# Altium project Matrix.PrjPCB
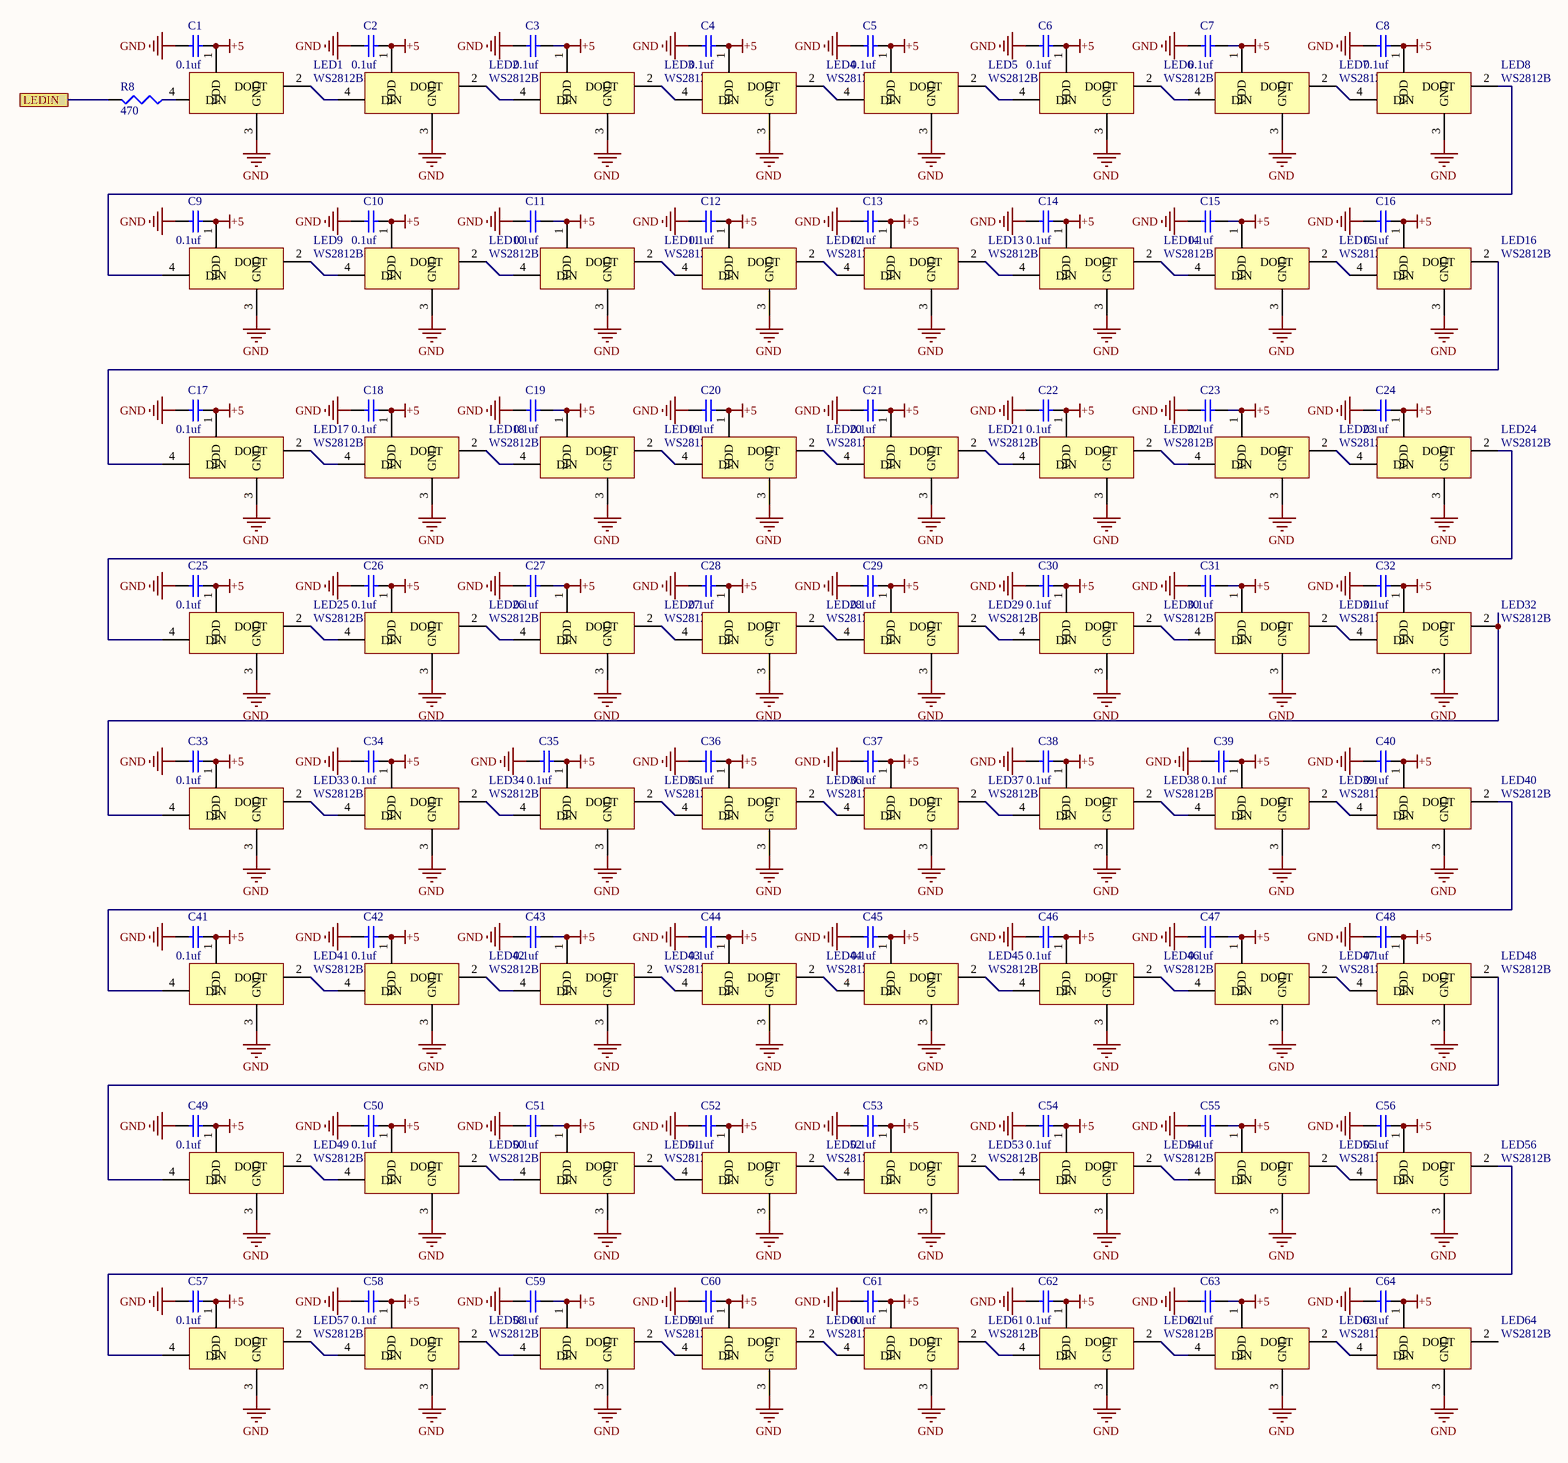
[diagram p0: led.SchDoc]
3 sheets, 297 parts. Net scope: flat (ports and power ports of the same name join across sheets).
Board files: MatrixRE.PcbDoc, MatrixC8.PcbDoc, TouchBar.PcbDoc
Sheets:
  led.SchDoc
  matrixkeypad.SchDoc
  MCU.SchDoc

## Sheet led.SchDoc
size A0

### Parts
(Parts that share a designator on the sheet are numbered #1, #2 ... from top to bottom, then left to right.)
C1#1  value 0.1uf  [C1206]  (hidden comment: Cap Semi)
C2#1  value 0.1uf  [C1206]  (hidden comment: Cap Semi)
C3#1  value 0.1uf  [C1206]  (hidden comment: Cap Semi)
C4#1  value 0.1uf  [C1206]  (hidden comment: Cap Semi)
C5#1  value 0.1uf  [C1206]  (hidden comment: Cap Semi)
C6#1  value 0.1uf  [C1206]  (hidden comment: Cap Semi)
C7#1  value 0.1uf  [C1206]  (hidden comment: Cap Semi)
C8#1  value 0.1uf  [C1206]  (hidden comment: Cap Semi)
C9#1  value 0.1uf  [C1206]  (hidden comment: Cap Semi)
C10#1  value 0.1uf  [C1206]  (hidden comment: Cap Semi)
C11#1  value 0.1uf  [C1206]  (hidden comment: Cap Semi)
C12#1  value 0.1uf  [C1206]  (hidden comment: Cap Semi)
C13  value 0.1uf  [C1206]  (hidden comment: Cap Semi)
C14  value 0.1uf  [C1206]  (hidden comment: Cap Semi)
C15  value 0.1uf  [C1206]  (hidden comment: Cap Semi)
C16  value 0.1uf  [C1206]  (hidden comment: Cap Semi)
C17  value 0.1uf  [C1206]  (hidden comment: Cap Semi)
C18  value 0.1uf  [C1206]  (hidden comment: Cap Semi)
C19  value 0.1uf  [C1206]  (hidden comment: Cap Semi)
C20  value 0.1uf  [C1206]  (hidden comment: Cap Semi)
C21  value 0.1uf  [C1206]  (hidden comment: Cap Semi)
C22  value 0.1uf  [C1206]  (hidden comment: Cap Semi)
C23  value 0.1uf  [C1206]  (hidden comment: Cap Semi)
C24  value 0.1uf  [C1206]  (hidden comment: Cap Semi)
C25  value 0.1uf  [C1206]  (hidden comment: Cap Semi)
C26  value 0.1uf  [C1206]  (hidden comment: Cap Semi)
C27  value 0.1uf  [C1206]  (hidden comment: Cap Semi)
C28  value 0.1uf  [C1206]  (hidden comment: Cap Semi)
C29  value 0.1uf  [C1206]  (hidden comment: Cap Semi)
C30  value 0.1uf  [C1206]  (hidden comment: Cap Semi)
C31  value 0.1uf  [C1206]  (hidden comment: Cap Semi)
C32  value 0.1uf  [C1206]  (hidden comment: Cap Semi)
C33  value 0.1uf  [C1206]  (hidden comment: Cap Semi)
C34  value 0.1uf  [C1206]  (hidden comment: Cap Semi)
C35  value 0.1uf  [C1206]  (hidden comment: Cap Semi)
C36  value 0.1uf  [C1206]  (hidden comment: Cap Semi)
C37  value 0.1uf  [C1206]  (hidden comment: Cap Semi)
C38  value 0.1uf  [C1206]  (hidden comment: Cap Semi)
C39  value 0.1uf  [C1206]  (hidden comment: Cap Semi)
C40  value 0.1uf  [C1206]  (hidden comment: Cap Semi)
C41  value 0.1uf  [C1206]  (hidden comment: Cap Semi)
C42  value 0.1uf  [C1206]  (hidden comment: Cap Semi)
C43  value 0.1uf  [C1206]  (hidden comment: Cap Semi)
C44  value 0.1uf  [C1206]  (hidden comment: Cap Semi)
C45  value 0.1uf  [C1206]  (hidden comment: Cap Semi)
C46  value 0.1uf  [C1206]  (hidden comment: Cap Semi)
C47  value 0.1uf  [C1206]  (hidden comment: Cap Semi)
C48  value 0.1uf  [C1206]  (hidden comment: Cap Semi)
C49  value 0.1uf  [C1206]  (hidden comment: Cap Semi)
C50  value 0.1uf  [C1206]  (hidden comment: Cap Semi)
C51  value 0.1uf  [C1206]  (hidden comment: Cap Semi)
C52  value 0.1uf  [C1206]  (hidden comment: Cap Semi)
C53  value 0.1uf  [C1206]  (hidden comment: Cap Semi)
C54  value 0.1uf  [C1206]  (hidden comment: Cap Semi)
C55  value 0.1uf  [C1206]  (hidden comment: Cap Semi)
C56  value 0.1uf  [C1206]  (hidden comment: Cap Semi)
C57  value 0.1uf  [C1206]  (hidden comment: Cap Semi)
C58  value 0.1uf  [C1206]  (hidden comment: Cap Semi)
C59  value 0.1uf  [C1206]  (hidden comment: Cap Semi)
C60  value 0.1uf  [C1206]  (hidden comment: Cap Semi)
C61  value 0.1uf  [C1206]  (hidden comment: Cap Semi)
C62  value 0.1uf  [C1206]  (hidden comment: Cap Semi)
C63  value 0.1uf  [C1206]  (hidden comment: Cap Semi)
C64  value 0.1uf  [C1206]  (hidden comment: Cap Semi)
LED1  WS2812B  [WS2812B]
LED2  WS2812B  [WS2812B]
LED3  WS2812B  [WS2812B]
LED4  WS2812B  [WS2812B]
LED5  WS2812B  [WS2812B]
LED6  WS2812B  [WS2812B]
LED7  WS2812B  [WS2812B]
LED8  WS2812B  [WS2812B]
LED9  WS2812B  [WS2812B]
LED10  WS2812B  [WS2812B]
LED11  WS2812B  [WS2812B]
LED12  WS2812B  [WS2812B]
LED13  WS2812B  [WS2812B]
LED14  WS2812B  [WS2812B]
LED15  WS2812B  [WS2812B]
LED16  WS2812B  [WS2812B]
LED17  WS2812B  [WS2812B]
LED18  WS2812B  [WS2812B]
LED19  WS2812B  [WS2812B]
LED20  WS2812B  [WS2812B]
LED21  WS2812B  [WS2812B]
LED22  WS2812B  [WS2812B]
LED23  WS2812B  [WS2812B]
LED24  WS2812B  [WS2812B]
LED25  WS2812B  [WS2812B]
LED26  WS2812B  [WS2812B]
LED27  WS2812B  [WS2812B]
LED28  WS2812B  [WS2812B]
LED29  WS2812B  [WS2812B]
LED30  WS2812B  [WS2812B]
LED31  WS2812B  [WS2812B]
LED32  WS2812B  [WS2812B]
LED33  WS2812B  [WS2812B]
LED34  WS2812B  [WS2812B]
LED35  WS2812B  [WS2812B]
LED36  WS2812B  [WS2812B]
LED37  WS2812B  [WS2812B]
LED38  WS2812B  [WS2812B]
LED39  WS2812B  [WS2812B]
LED40  WS2812B  [WS2812B]
LED41  WS2812B  [WS2812B]
LED42  WS2812B  [WS2812B]
LED43  WS2812B  [WS2812B]
LED44  WS2812B  [WS2812B]
LED45  WS2812B  [WS2812B]
LED46  WS2812B  [WS2812B]
LED47  WS2812B  [WS2812B]
LED48  WS2812B  [WS2812B]
LED49  WS2812B  [WS2812B]
LED50  WS2812B  [WS2812B]
LED51  WS2812B  [WS2812B]
LED52  WS2812B  [WS2812B]
LED53  WS2812B  [WS2812B]
LED54  WS2812B  [WS2812B]
LED55  WS2812B  [WS2812B]
LED56  WS2812B  [WS2812B]
LED57  WS2812B  [WS2812B]
LED58  WS2812B  [WS2812B]
LED59  WS2812B  [WS2812B]
LED60  WS2812B  [WS2812B]
LED61  WS2812B  [WS2812B]
LED62  WS2812B  [WS2812B]
LED63  WS2812B  [WS2812B]
LED64  WS2812B  [WS2812B]
R8#1  value 470  [C1206]  (hidden comment: res)

### Ports
LEDIN

### Nets
+5: C1#1.2 C2#1.2 C3#1.2 C4#1.2 C5#1.2 C6#1.2 C7#1.2 C8#1.2 C9#1.2 C10#1.2 C11#1.2 C12#1.2 C13.2 C14.2 C15.2 C16.2 C17.2 C18.2 C19.2 C20.2 C21.2 C22.2 C23.2 C24.2 C25.2 C26.2 C27.2 C28.2 C29.2 C30.2 C31.2 C32.2 C33.2 C34.2 C35.2 C36.2 C37.2 C38.2 C39.2 C40.2 C41.2 C42.2 C43.2 C44.2 C45.2 C46.2 C47.2 C48.2 C49.2 C50.2 C51.2 C52.2 C53.2 C54.2 C55.2 C56.2 C57.2 C58.2 C59.2 C60.2 C61.2 C62.2 C63.2 C64.2 LED1.1(VDD) LED2.1(VDD) LED3.1(VDD) LED4.1(VDD) LED5.1(VDD) LED6.1(VDD) LED7.1(VDD) LED8.1(VDD) LED9.1(VDD) LED10.1(VDD) LED11.1(VDD) LED12.1(VDD) LED13.1(VDD) LED14.1(VDD) LED15.1(VDD) LED16.1(VDD) LED17.1(VDD) LED18.1(VDD) LED19.1(VDD) LED20.1(VDD) LED21.1(VDD) LED22.1(VDD) LED23.1(VDD) LED24.1(VDD) LED25.1(VDD) LED26.1(VDD) LED27.1(VDD) LED28.1(VDD) LED29.1(VDD) LED30.1(VDD) LED31.1(VDD) LED32.1(VDD) LED33.1(VDD) LED34.1(VDD) LED35.1(VDD) LED36.1(VDD) LED37.1(VDD) LED38.1(VDD) LED39.1(VDD) LED40.1(VDD) LED41.1(VDD) LED42.1(VDD) LED43.1(VDD) LED44.1(VDD) LED45.1(VDD) LED46.1(VDD) LED47.1(VDD) LED48.1(VDD) LED49.1(VDD) LED50.1(VDD) LED51.1(VDD) LED52.1(VDD) LED53.1(VDD) LED54.1(VDD) LED55.1(VDD) LED56.1(VDD) LED57.1(VDD) LED58.1(VDD) LED59.1(VDD) LED60.1(VDD) LED61.1(VDD) LED62.1(VDD) LED63.1(VDD) LED64.1(VDD)
GND: C1#1.1 C2#1.1 C3#1.1 C4#1.1 C5#1.1 C6#1.1 C7#1.1 C8#1.1 C9#1.1 C10#1.1 C11#1.1 C12#1.1 C13.1 C14.1 C15.1 C16.1 C17.1 C18.1 C19.1 C20.1 C21.1 C22.1 C23.1 C24.1 C25.1 C26.1 C27.1 C28.1 C29.1 C30.1 C31.1 C32.1 C33.1 C34.1 C35.1 C36.1 C37.1 C38.1 C39.1 C40.1 C41.1 C42.1 C43.1 C44.1 C45.1 C46.1 C47.1 C48.1 C49.1 C50.1 C51.1 C52.1 C53.1 C54.1 C55.1 C56.1 C57.1 C58.1 C59.1 C60.1 C61.1 C62.1 C63.1 C64.1 LED1.3(GND) LED2.3(GND) LED3.3(GND) LED4.3(GND) LED5.3(GND) LED6.3(GND) LED7.3(GND) LED8.3(GND) LED9.3(GND) LED10.3(GND) LED11.3(GND) LED12.3(GND) LED13.3(GND) LED14.3(GND) LED15.3(GND) LED16.3(GND) LED17.3(GND) LED18.3(GND) LED19.3(GND) LED20.3(GND) LED21.3(GND) LED22.3(GND) LED23.3(GND) LED24.3(GND) LED25.3(GND) LED26.3(GND) LED27.3(GND) LED28.3(GND) LED29.3(GND) LED30.3(GND) LED31.3(GND) LED32.3(GND) LED33.3(GND) LED34.3(GND) LED35.3(GND) LED36.3(GND) LED37.3(GND) LED38.3(GND) LED39.3(GND) LED40.3(GND) LED41.3(GND) LED42.3(GND) LED43.3(GND) LED44.3(GND) LED45.3(GND) LED46.3(GND) LED47.3(GND) LED48.3(GND) LED49.3(GND) LED50.3(GND) LED51.3(GND) LED52.3(GND) LED53.3(GND) LED54.3(GND) LED55.3(GND) LED56.3(GND) LED57.3(GND) LED58.3(GND) LED59.3(GND) LED60.3(GND) LED61.3(GND) LED62.3(GND) LED63.3(GND) LED64.3(GND)
NetLED1_2: LED1.2(DOUT) LED2.4(DIN)
NetLED1_4: LED1.4(DIN) R8#1.1
NetLED2_2: LED2.2(DOUT) LED3.4(DIN)
NetLED3_2: LED3.2(DOUT) LED4.4(DIN)
NetLED4_2: LED4.2(DOUT) LED5.4(DIN)
NetLED5_2: LED5.2(DOUT) LED6.4(DIN)
NetLED6_2: LED6.2(DOUT) LED7.4(DIN)
NetLED7_2: LED7.2(DOUT) LED8.4(DIN)
NetLED8_2: LED8.2(DOUT) LED9.4(DIN)
NetLED9_2: LED9.2(DOUT) LED10.4(DIN)
NetLED10_2: LED10.2(DOUT) LED11.4(DIN)
NetLED11_2: LED11.2(DOUT) LED12.4(DIN)
NetLED12_2: LED12.2(DOUT) LED13.4(DIN)
NetLED13_2: LED13.2(DOUT) LED14.4(DIN)
NetLED14_2: LED14.2(DOUT) LED15.4(DIN)
NetLED15_2: LED15.2(DOUT) LED16.4(DIN)
NetLED16_2: LED16.2(DOUT) LED17.4(DIN)
NetLED17_2: LED17.2(DOUT) LED18.4(DIN)
NetLED18_2: LED18.2(DOUT) LED19.4(DIN)
NetLED19_2: LED19.2(DOUT) LED20.4(DIN)
NetLED20_2: LED20.2(DOUT) LED21.4(DIN)
NetLED21_2: LED21.2(DOUT) LED22.4(DIN)
NetLED22_2: LED22.2(DOUT) LED23.4(DIN)
NetLED23_2: LED23.2(DOUT) LED24.4(DIN)
NetLED24_2: LED24.2(DOUT) LED25.4(DIN)
NetLED25_2: LED25.2(DOUT) LED26.4(DIN)
NetLED26_2: LED26.2(DOUT) LED27.4(DIN)
NetLED27_2: LED27.2(DOUT) LED28.4(DIN)
NetLED28_2: LED28.2(DOUT) LED29.4(DIN)
NetLED29_2: LED29.2(DOUT) LED30.4(DIN)
NetLED30_2: LED30.2(DOUT) LED31.4(DIN)
NetLED31_2: LED31.2(DOUT) LED32.4(DIN)
NetLED32_2: LED32.2(DOUT) LED33.4(DIN)
NetLED33_2: LED33.2(DOUT) LED34.4(DIN)
NetLED34_2: LED34.2(DOUT) LED35.4(DIN)
NetLED35_2: LED35.2(DOUT) LED36.4(DIN)
NetLED36_2: LED36.2(DOUT) LED37.4(DIN)
NetLED37_2: LED37.2(DOUT) LED38.4(DIN)
NetLED38_2: LED38.2(DOUT) LED39.4(DIN)
NetLED39_2: LED39.2(DOUT) LED40.4(DIN)
NetLED40_2: LED40.2(DOUT) LED41.4(DIN)
NetLED41_2: LED41.2(DOUT) LED42.4(DIN)
NetLED42_2: LED42.2(DOUT) LED43.4(DIN)
NetLED43_2: LED43.2(DOUT) LED44.4(DIN)
NetLED44_2: LED44.2(DOUT) LED45.4(DIN)
NetLED45_2: LED45.2(DOUT) LED46.4(DIN)
NetLED46_2: LED46.2(DOUT) LED47.4(DIN)
NetLED47_2: LED47.2(DOUT) LED48.4(DIN)
NetLED48_2: LED48.2(DOUT) LED49.4(DIN)
NetLED49_2: LED49.2(DOUT) LED50.4(DIN)
NetLED50_2: LED50.2(DOUT) LED51.4(DIN)
NetLED51_2: LED51.2(DOUT) LED52.4(DIN)
NetLED52_2: LED52.2(DOUT) LED53.4(DIN)
NetLED53_2: LED53.2(DOUT) LED54.4(DIN)
NetLED54_2: LED54.2(DOUT) LED55.4(DIN)
NetLED55_2: LED55.2(DOUT) LED56.4(DIN)
NetLED56_2: LED56.2(DOUT) LED57.4(DIN)
NetLED57_2: LED57.2(DOUT) LED58.4(DIN)
NetLED58_2: LED58.2(DOUT) LED59.4(DIN)
NetLED59_2: LED59.2(DOUT) LED60.4(DIN)
NetLED60_2: LED60.2(DOUT) LED61.4(DIN)
NetLED61_2: LED61.2(DOUT) LED62.4(DIN)
NetLED62_2: LED62.2(DOUT) LED63.4(DIN)
NetLED63_2: LED63.2(DOUT) LED64.4(DIN)
NetR8#1_2: R8#1.2 ; port LEDIN

Not connected (* = marked no-connect by the designer): LED64 2(DOUT)

### Library data of the parts
C1#1 C2#1 C3#1 C4#1 C5#1 C6#1 C7#1 C8#1 C9#1 C10#1 C11#1 C12#1 C13-C64 = Cap Semi: Capacitor (Semiconductor SIM Model); Published: 8-Jun-2000; LatestRevisionDate: 29-May-2009; LatestRevisionNote: IPC-7351 Footprint Added.; PackageReference: C1206; Publisher: Altium Limited; PackageDescription: Chip Capacitor
LED1-LED64 = WS2812B: 3535
R8#1 = Res3: Resistor; Published: 8-Jun-2000; LatestRevisionDate: 29-May-2009; LatestRevisionNote: IPC-7351 Footprint Added.; PackageReference: J1-0603; Publisher: Altium Limited; PackageDescription: Chip Resistor

## Sheet matrixkeypad.SchDoc
size A4
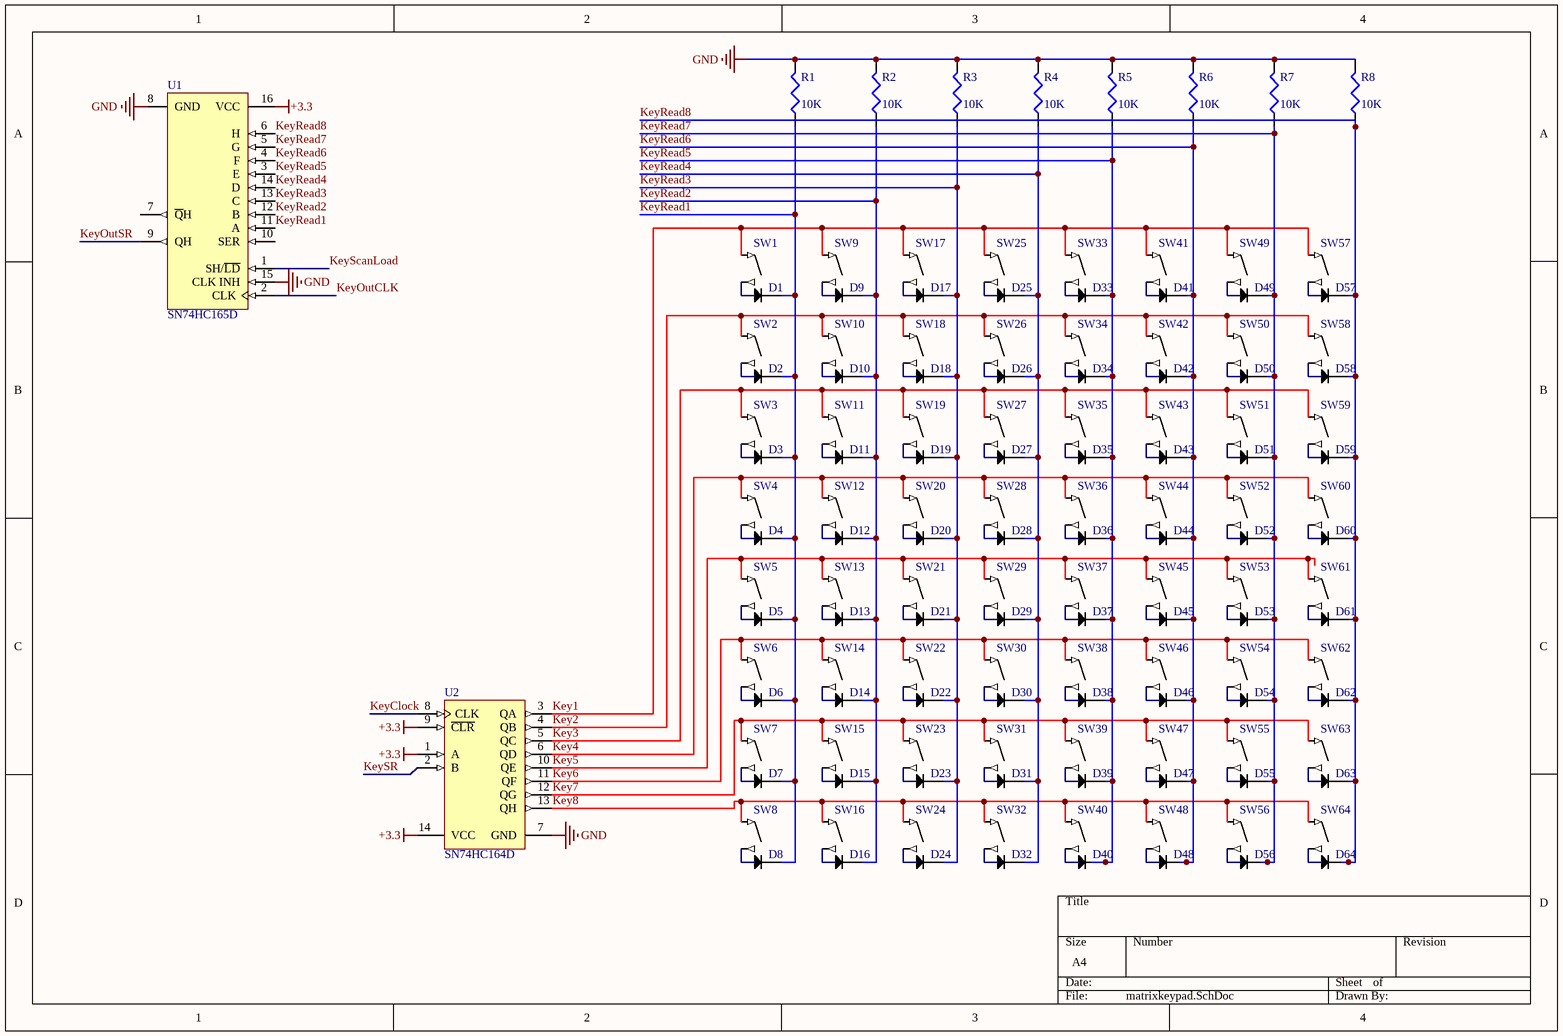
[diagram p1: matrixkeypad.SchDoc]

### Parts
(Parts that share a designator on the sheet are numbered #1, #2 ... from top to bottom, then left to right.)
D1#1  1N4148  [SOD123]  (value not drawn)
D2#1  1N4148  [SOD123]  (value not drawn)
D3  1N4148  [SOD123]  (value not drawn)
D4  1N4148  [SOD123]  (value not drawn)
D5  1N4148  [SOD123]  (value not drawn)
D6  1N4148  [SOD123]  (value not drawn)
D7  1N4148  [SOD123]  (value not drawn)
D8  1N4148  [SOD123]  (value not drawn)
D9  1N4148  [SOD123]  (value not drawn)
D10  1N4148  [SOD123]  (value not drawn)
D11  1N4148  [SOD123]  (value not drawn)
D12  1N4148  [SOD123]  (value not drawn)
D13  1N4148  [SOD123]  (value not drawn)
D14  1N4148  [SOD123]  (value not drawn)
D15  1N4148  [SOD123]  (value not drawn)
D16  1N4148  [SOD123]  (value not drawn)
D17  1N4148  [SOD123]  (value not drawn)
D18  1N4148  [SOD123]  (value not drawn)
D19  1N4148  [SOD123]  (value not drawn)
D20  1N4148  [SOD123]  (value not drawn)
D21  1N4148  [SOD123]  (value not drawn)
D22  1N4148  [SOD123]  (value not drawn)
D23  1N4148  [SOD123]  (value not drawn)
D24  1N4148  [SOD123]  (value not drawn)
D25  1N4148  [SOD123]  (value not drawn)
D26  1N4148  [SOD123]  (value not drawn)
D27  1N4148  [SOD123]  (value not drawn)
D28  1N4148  [SOD123]  (value not drawn)
D29  1N4148  [SOD123]  (value not drawn)
D30  1N4148  [SOD123]  (value not drawn)
D31  1N4148  [SOD123]  (value not drawn)
D32  1N4148  [SOD123]  (value not drawn)
D33  1N4148  [SOD123]  (value not drawn)
D34  1N4148  [SOD123]  (value not drawn)
D35  1N4148  [SOD123]  (value not drawn)
D36  1N4148  [SOD123]  (value not drawn)
D37  1N4148  [SOD123]  (value not drawn)
D38  1N4148  [SOD123]  (value not drawn)
D39  1N4148  [SOD123]  (value not drawn)
D40  1N4148  [SOD123]  (value not drawn)
D41  1N4148  [SOD123]  (value not drawn)
D42  1N4148  [SOD123]  (value not drawn)
D43  1N4148  [SOD123]  (value not drawn)
D44  1N4148  [SOD123]  (value not drawn)
D45  1N4148  [SOD123]  (value not drawn)
D46  1N4148  [SOD123]  (value not drawn)
D47  1N4148  [SOD123]  (value not drawn)
D48  1N4148  [SOD123]  (value not drawn)
D49  1N4148  [SOD123]  (value not drawn)
D50  1N4148  [SOD123]  (value not drawn)
D51  1N4148  [SOD123]  (value not drawn)
D52  1N4148  [SOD123]  (value not drawn)
D53  1N4148  [SOD123]  (value not drawn)
D54  1N4148  [SOD123]  (value not drawn)
D55  1N4148  [SOD123]  (value not drawn)
D56  1N4148  [SOD123]  (value not drawn)
D57  1N4148  [SOD123]  (value not drawn)
D58  1N4148  [SOD123]  (value not drawn)
D59  1N4148  [SOD123]  (value not drawn)
D60  1N4148  [SOD123]  (value not drawn)
D61  1N4148  [SOD123]  (value not drawn)
D62  1N4148  [SOD123]  (value not drawn)
D63  1N4148  [SOD123]  (value not drawn)
D64  1N4148  [SOD123]  (value not drawn)
R1#1  value 10K  [C1206]  (hidden comment: res)
R2#1  value 10K  [C1206]  (hidden comment: res)
R3#1  value 10K  [C1206]  (hidden comment: res)
R4#1  value 10K  [C1206]  (hidden comment: res)
R5#1  value 10K  [C1206]  (hidden comment: res)
R6#1  value 10K  [C1206]  (hidden comment: res)
R7#1  value 10K  [C1206]  (hidden comment: res)
R8#2  value 10K  [C1206]  (hidden comment: res)
SW1  (no value)  [PAD]
SW2  (no value)  [PAD]
SW3  (no value)  [PAD]
SW4  (no value)  [PAD]
SW5  (no value)  [PAD]
SW6  (no value)  [PAD]
SW7  (no value)  [PAD]
SW8  (no value)  [PAD]
SW9  (no value)  [PAD]
SW10  (no value)  [PAD]
SW11  (no value)  [PAD]
SW12  (no value)  [PAD]
SW13  (no value)  [PAD]
SW14  (no value)  [PAD]
SW15  (no value)  [PAD]
SW16  (no value)  [PAD]
SW17  (no value)  [PAD]
SW18  (no value)  [PAD]
SW19  (no value)  [PAD]
SW20  (no value)  [PAD]
SW21  (no value)  [PAD]
SW22  (no value)  [PAD]
SW23  (no value)  [PAD]
SW24  (no value)  [PAD]
SW25  (no value)  [PAD]
SW26  (no value)  [PAD]
SW27  (no value)  [PAD]
SW28  (no value)  [PAD]
SW29  (no value)  [PAD]
SW30  (no value)  [PAD]
SW31  (no value)  [PAD]
SW32  (no value)  [PAD]
SW33  (no value)  [PAD]
SW34  (no value)  [PAD]
SW35  (no value)  [PAD]
SW36  (no value)  [PAD]
SW37  (no value)  [PAD]
SW38  (no value)  [PAD]
SW39  (no value)  [PAD]
SW40  (no value)  [PAD]
SW41  (no value)  [PAD]
SW42  (no value)  [PAD]
SW43  (no value)  [PAD]
SW44  (no value)  [PAD]
SW45  (no value)  [PAD]
SW46  (no value)  [PAD]
SW47  (no value)  [PAD]
SW48  (no value)  [PAD]
SW49  (no value)  [PAD]
SW50  (no value)  [PAD]
SW51  (no value)  [PAD]
SW52  (no value)  [PAD]
SW53  (no value)  [PAD]
SW54  (no value)  [PAD]
SW55  (no value)  [PAD]
SW56  (no value)  [PAD]
SW57  (no value)  [PAD]
SW58  (no value)  [PAD]
SW59  (no value)  [PAD]
SW60  (no value)  [PAD]
SW61  (no value)  [PAD]
SW62  (no value)  [PAD]
SW63  (no value)  [PAD]
SW64  (no value)  [PAD]
U1  SN74HC165D  [D0016A_N]
U2  SN74HC164D  [D0014A_N]

### Nets
+3.3: U1.16(VCC) U2.1(A) U2.9(~{CLR}) U2.14(VCC)
GND: R1#1.2 R2#1.2 R3#1.2 R4#1.2 R5#1.2 R6#1.2 R7#1.2 R8#2.2 U1.15(CLK_INH) U2.7(GND)
Key1: SW1.1 SW9.1 SW17.1 SW25.1 SW33.1 SW41.1 SW49.1 SW57.1 U2.3(QA)
Key2: SW2.1 SW10.1 SW18.1 SW26.1 SW34.1 SW42.1 SW50.1 SW58.1 U2.4(QB)
Key3: SW3.1 SW11.1 SW19.1 SW27.1 SW35.1 SW43.1 SW51.1 SW59.1 U2.5(QC)
Key4: SW4.1 SW12.1 SW20.1 SW28.1 SW36.1 SW44.1 SW52.1 SW60.1 U2.6(QD)
Key5: SW5.1 SW13.1 SW21.1 SW29.1 SW37.1 SW45.1 SW53.1 SW61.1 U2.10(QE)
Key6: SW6.1 SW14.1 SW22.1 SW30.1 SW38.1 SW46.1 SW54.1 SW62.1 U2.11(QF)
Key7: SW7.1 SW15.1 SW23.1 SW31.1 SW39.1 SW47.1 SW55.1 SW63.1 U2.12(QG)
Key8: SW8.1 SW16.1 SW24.1 SW32.1 SW40.1 SW48.1 SW56.1 SW64.1 U2.13(QH)
KeyClock: U2.8(CLK)
KeyOutCLK: U1.2(CLK)
KeyOutSR: U1.9(QH)
KeyRead1: D1#1.2 D2#1.2 D3.2 D4.2 D5.2 D6.2 D7.2 D8.2 R1#1.1 U1.11(A)
KeyRead2: D9.2 D10.2 D11.2 D12.2 D13.2 D14.2 D15.2 D16.2 R2#1.1 U1.12(B)
KeyRead3: D17.2 D18.2 D19.2 D20.2 D21.2 D22.2 D23.2 D24.2 R3#1.1 U1.13(C)
KeyRead4: D25.2 D26.2 D27.2 D28.2 D29.2 D30.2 D31.2 D32.2 R4#1.1 U1.14(D)
KeyRead5: D33.2 D34.2 D35.2 D36.2 D37.2 D38.2 D39.2 D40.2 R5#1.1 U1.3(E)
KeyRead6: D41.2 D42.2 D43.2 D44.2 D45.2 D46.2 D47.2 D48.2 R6#1.1 U1.4(F)
KeyRead7: D49.2 D50.2 D51.2 D52.2 D53.2 D54.2 D55.2 D56.2 R7#1.1 U1.5(G)
KeyRead8: D57.2 D58.2 D59.2 D60.2 D61.2 D62.2 D63.2 D64.2 R8#2.1 U1.6(H)
KeyScanLoad: U1.1(SH/~{LD})
KeySR: U2.2(B)
NetD1#1_1: D1#1.1 SW1.2(Out)
NetD2#1_1: D2#1.1 SW2.2(Out)
NetD3_1: D3.1 SW3.2(Out)
NetD4_1: D4.1 SW4.2(Out)
NetD5_1: D5.1 SW5.2(Out)
NetD6_1: D6.1 SW6.2(Out)
NetD7_1: D7.1 SW7.2(Out)
NetD8_1: D8.1 SW8.2(Out)
NetD9_1: D9.1 SW9.2(Out)
NetD10_1: D10.1 SW10.2(Out)
NetD11_1: D11.1 SW11.2(Out)
NetD12_1: D12.1 SW12.2(Out)
NetD13_1: D13.1 SW13.2(Out)
NetD14_1: D14.1 SW14.2(Out)
NetD15_1: D15.1 SW15.2(Out)
NetD16_1: D16.1 SW16.2(Out)
NetD17_1: D17.1 SW17.2(Out)
NetD18_1: D18.1 SW18.2(Out)
NetD19_1: D19.1 SW19.2(Out)
NetD20_1: D20.1 SW20.2(Out)
NetD21_1: D21.1 SW21.2(Out)
NetD22_1: D22.1 SW22.2(Out)
NetD23_1: D23.1 SW23.2(Out)
NetD24_1: D24.1 SW24.2(Out)
NetD25_1: D25.1 SW25.2(Out)
NetD26_1: D26.1 SW26.2(Out)
NetD27_1: D27.1 SW27.2(Out)
NetD28_1: D28.1 SW28.2(Out)
NetD29_1: D29.1 SW29.2(Out)
NetD30_1: D30.1 SW30.2(Out)
NetD31_1: D31.1 SW31.2(Out)
NetD32_1: D32.1 SW32.2(Out)
NetD33_1: D33.1 SW33.2(Out)
NetD34_1: D34.1 SW34.2(Out)
NetD35_1: D35.1 SW35.2(Out)
NetD36_1: D36.1 SW36.2(Out)
NetD37_1: D37.1 SW37.2(Out)
NetD38_1: D38.1 SW38.2(Out)
NetD39_1: D39.1 SW39.2(Out)
NetD40_1: D40.1 SW40.2(Out)
NetD41_1: D41.1 SW41.2(Out)
NetD42_1: D42.1 SW42.2(Out)
NetD43_1: D43.1 SW43.2(Out)
NetD44_1: D44.1 SW44.2(Out)
NetD45_1: D45.1 SW45.2(Out)
NetD46_1: D46.1 SW46.2(Out)
NetD47_1: D47.1 SW47.2(Out)
NetD48_1: D48.1 SW48.2(Out)
NetD49_1: D49.1 SW49.2(Out)
NetD50_1: D50.1 SW50.2(Out)
NetD51_1: D51.1 SW51.2(Out)
NetD52_1: D52.1 SW52.2(Out)
NetD53_1: D53.1 SW53.2(Out)
NetD54_1: D54.1 SW54.2(Out)
NetD55_1: D55.1 SW55.2(Out)
NetD56_1: D56.1 SW56.2(Out)
NetD57_1: D57.1 SW57.2(Out)
NetD58_1: D58.1 SW58.2(Out)
NetD59_1: D59.1 SW59.2(Out)
NetD60_1: D60.1 SW60.2(Out)
NetD61_1: D61.1 SW61.2(Out)
NetD62_1: D62.1 SW62.2(Out)
NetD63_1: D63.1 SW63.2(Out)
NetD64_1: D64.1 SW64.2(Out)

Not connected (* = marked no-connect by the designer): U1 7(~{Q}H) 8(GND) 10(SER)

### Notes on the sheet
- Labels drawn without touching a wire or pin: GND

### Library data of the parts
R1#1 R2#1 R3#1 R4#1 R5#1 R6#1 R7#1 R8#2 = Res3: Resistor; Published: 8-Jun-2000; LatestRevisionDate: 29-May-2009; LatestRevisionNote: IPC-7351 Footprint Added.; PackageReference: J1-0603; Publisher: Altium Limited; PackageDescription: Chip Resistor
SW1-SW64 = SW
U1 = SN74HC165D: 8-Bit Parallel-Load Shift Registers, D0016A, TUBE; Manufacturer: Texas Instruments; Technology Family: HC; VCC(Min)(V): 2; VCC(Max)(V): 6; F @ Nom Voltage(Max)(Mhz): 28; ICC @ Nom Voltage(Max)(mA): 0.08; tpd @ Nom Voltage(Max)(ns): 38; Output Drive (IOL/IOH)(Max)(mA): 5.2/-5.2; Input Type: CMOS; 3-State Output: No; Rating: Catalog; Bits: 8; DatasheetVersion: SCLS116G; PackageReference: D0016A; Generic Part Number: SN74HC165; Voltage(Nom)(V): 6; Output Type: CMOS; Operating Temperature Range(C): -40 to 125; Code_JEDEC: MS-012 variation AC; PartNumber: SN74HC165D; ComponentLink1Description: Manufacturer URL; ComponentLink1URL: http://www.ti.com/; ComponentLink2Description: Datasheet; ComponentLink2URL: http://www.ti.com/lit/ds/symlink/sn74hc165.pdf; ComponentLink3Description: Package Specification; ComponentLink3URL: http://www.ti.com/lit/ml/mpds178g/mpds178g.pdf
U2 = SN74HC164D: 8-Bit Parallel-Out Serial Shift Registers, D0014A, TUBE; Manufacturer: Texas Instruments; Technology Family: HC; VCC(Min)(V): 2; VCC(Max)(V): 6; F @ Nom Voltage(Max)(Mhz): 28; ICC @ Nom Voltage(Max)(mA): 0.08; tpd @ Nom Voltage(Max)(ns): 38; Output Drive (IOL/IOH)(Max)(mA): 5.2/-5.2; Input Type: CMOS; 3-State Output: No; Rating: Catalog; Bits: 8; DatasheetVersion: SCLS115F; PackageReference: D0014A; Generic Part Number: SN74HC164; Voltage(Nom)(V): 6; Output Type: CMOS; Operating Temperature Range(C): -40 to 125; Code_JEDEC: MS-012; PartNumber: SN74HC164D; ComponentLink1Description: Manufacturer URL; ComponentLink1URL: http://www.ti.com/; ComponentLink2Description: Datasheet; ComponentLink2URL: http://www.ti.com/lit/ds/symlink/sn74hc164.pdf; ComponentLink3Description: Package Specification; ComponentLink3URL: http://www.ti.com/lit/ml/mpds177g/mpds177g.pdf

## Sheet MCU.SchDoc
size 320 x 193 mm
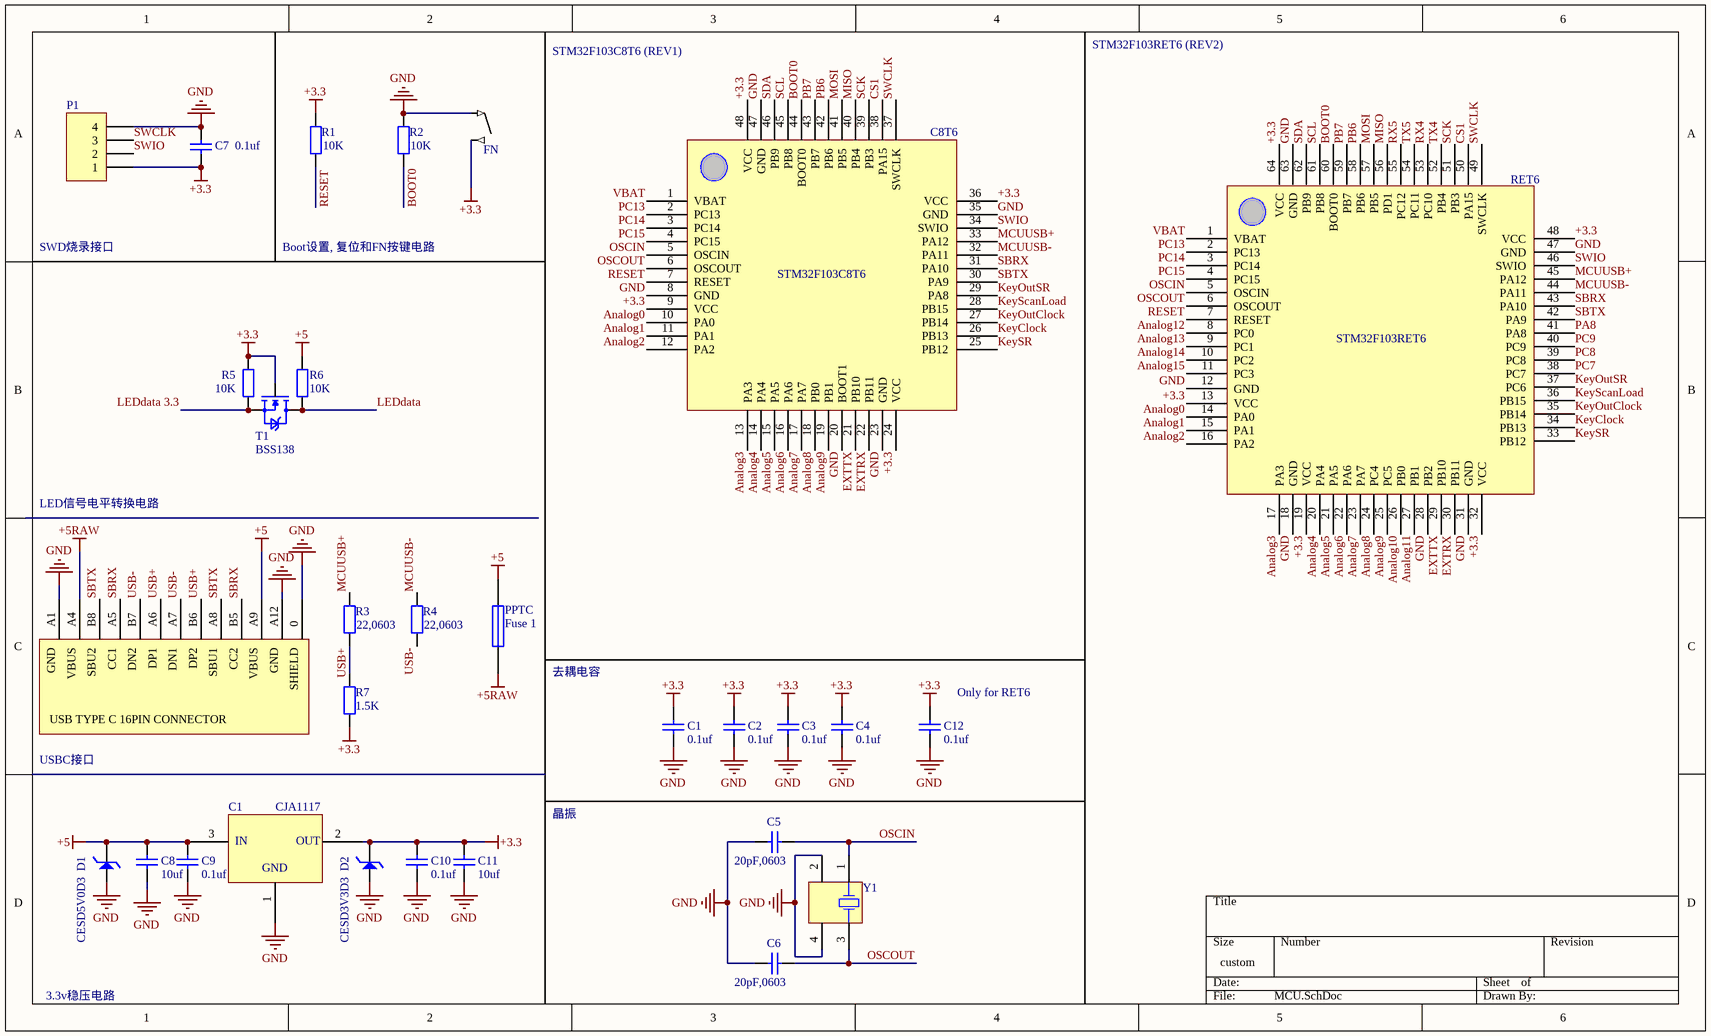
[diagram p2: MCU.SchDoc]

### Parts
(Parts that share a designator on the sheet are numbered #1, #2 ... from top to bottom, then left to right.)
1  System  [USBC 16PIN -1.6]  (value not drawn)
C1#2  value 0.1uf  [C1206]  (hidden comment: System)
C1#3  CJA1117  [SOT89-3L]
C2#2  value 0.1uf  [C1206]  (hidden comment: System)
C3#2  value 0.1uf  [C1206]  (hidden comment: System)
C4#2  value 0.1uf  [C1206]  (hidden comment: System)
C5#2  value 20pF,0603  [1608[0603]]  (hidden comment: System)
C6#2  value 20pF,0603  [1608[0603]]  (hidden comment: System)
C7#2  value 0.1uf  [C1206]  (hidden comment: System)
C8#2  value 10uf  [C1206]  (hidden comment: System)
C8T6  System  [STM-LQFP48_L]  (value not drawn)
C9#2  value 0.1uf  [C1206]  (hidden comment: System)
C10#2  value 0.1uf  [C1206]  (hidden comment: System)
C11#2  value 10uf  [C1206]  (hidden comment: System)
C12#2  value 0.1uf  [C1206]  (hidden comment: System)
D1#2  CESD5V0D3  [SOD323]
D2#2  CESD3V3D3  [SOD323]
FN  System  [dome button]  (value not drawn)
P1  System  [HDR1X4]  (value not drawn)
PPTC  Fuse 1  [C1206]
R1#2  value 10K  [C1206]  (hidden comment: System)
R2#2  value 10K  [C1206]  (hidden comment: System)
R3#2  value 22,0603  [1608[0603]]  (hidden comment: System)
R4#2  value 22,0603  [1608[0603]]  (hidden comment: System)
R5#2  value 10K  [C1206]  (hidden comment: System)
R6#2  value 10K  [C1206]  (hidden comment: System)
R7#2  value 1.5K  [C1206]  (hidden comment: System)
RET6  RET6  [STM-LQFP64_L]  (value not drawn)
T1  BSS138  [SOT23]
Y1  System  [3225]  (value not drawn)

### Nets
+3.3: C1#2.2 C1#3.2 C2#2.2 C3#2.2 C4#2.2 C7#2.1 C8T6.9(VCC) C8T6.24(VCC) C8T6.36(VCC) C8T6.48(VCC) C10#2.2 C11#2.2 C12#2.2 D2#2.2 FN.2(Out) P1.1 R1#2.2 R5#2.2 R7#2.2 RET6.13(VCC) RET6.19(VCC) RET6.32(VCC) RET6.48(VCC) RET6.64(VCC) T1.1
+5: 1.A9 C1#3.3 C8#2.2 C9#2.2 D1#2.2 PPTC.2 R6#2.2
+5RAW: 1.A4 PPTC.1
GND: 1.0 1.A1 1.A12 C1#2.1 C1#3.1 C2#2.1 C3#2.1 C4#2.1 C5#2.1 C6#2.1 C7#2.2 C8#2.1 C8T6.8(GND) C8T6.20(BOOT1) C8T6.23(GND) C8T6.35(GND) C8T6.47(GND) C9#2.1 C10#2.1 C11#2.1 C12#2.1 FN.1 P1.4 R2#2.2 RET6.12(GND) RET6.18(GND) RET6.28(PB2) RET6.31(GND) RET6.47(GND) RET6.63(GND) Y1.2(NC) Y1.4(NC)
Analog0: C8T6.10(PA0) RET6.14(PA0)
Analog1: C8T6.11(PA1) RET6.15(PA1)
Analog2: C8T6.12(PA2) RET6.16(PA2)
Analog3: C8T6.13(PA3) RET6.17(PA3)
Analog4: C8T6.14(PA4) RET6.20(PA4)
Analog5: C8T6.15(PA5) RET6.21(PA5)
Analog6: C8T6.16(PA6) RET6.22(PA6)
Analog7: C8T6.17(PA7) RET6.23(PA7)
Analog8: C8T6.18(PB0) RET6.24(PC4)
Analog9: C8T6.19(PB1) RET6.25(PC5)
Analog10: RET6.26(PB0)
Analog11: RET6.27(PB1)
Analog12: RET6.8(PC0)
Analog13: RET6.9(PC1)
Analog14: RET6.10(PC2)
Analog15: RET6.11(PC3)
BOOT0: C8T6.44(BOOT0) R2#2.1 RET6.60(BOOT0)
CS1: C8T6.38(PA15) RET6.50(PA15)
EXTRX: C8T6.22(PB11) RET6.30(PB11)
EXTTX: C8T6.21(PB10) RET6.29(PB10)
KeyClock: C8T6.26(PB13) RET6.34(PB13)
KeyOutClock: C8T6.27(PB14) RET6.35(PB14)
KeyOutSR: C8T6.29(PA8) RET6.37(PC6)
KeyScanLoad: C8T6.28(PB15) RET6.36(PB15)
KeySR: C8T6.25(PB12) RET6.33(PB12)
LEDdata: R6#2.1 T1.3
LEDdata 3.3: R5#2.1 T1.2
MCUUSB+: C8T6.33(PA12) R3#2.2 RET6.45(PA12)
MCUUSB-: C8T6.32(PA11) R4#2.2 RET6.44(PA11)
MISO: C8T6.40(PB4) RET6.56(PD1)
MOSI: C8T6.41(PB5) RET6.57(PB5)
OSCIN: C5#2.2 C8T6.5(OSCIN) RET6.5(OSCIN) Y1.1(OSC1)
OSCOUT: C6#2.2 C8T6.6(OSCOUT) RET6.6(OSCOUT) Y1.3(OSC2)
PA8: RET6.41(PA8)
PB6: C8T6.42(PB6) RET6.58(PB6)
PB7: C8T6.43(PB7) RET6.59(PB7)
PC7: RET6.38(PC7)
PC8: RET6.39(PC8)
PC9: RET6.40(PC9)
PC13: C8T6.2(PC13) RET6.2(PC13)
PC14: C8T6.3(PC14) RET6.3(PC14)
PC15: C8T6.4(PC15) RET6.4(PC15)
RESET: C8T6.7(RESET) R1#2.1 RET6.7(RESET)
RX4: RET6.53(PC10)
RX5: RET6.55(PC12)
SBRX: 1.A5 1.B5 C8T6.31(PA10) RET6.43(PA10)
SBTX: 1.A8 1.B8 C8T6.30(PA9) RET6.42(PA9)
SCK: C8T6.39(PB3) RET6.51(PB3)
SCL: C8T6.45(PB8) RET6.61(PB8)
SDA: C8T6.46(PB9) RET6.62(PB9)
SWCLK: C8T6.37(SWCLK) P1.3 RET6.49(SWCLK)
SWIO: C8T6.34(SWIO) P1.2 RET6.46(SWIO)
TX4: RET6.52(PB4)
TX5: RET6.54(PC11)
USB+: 1.A6 1.B6 R3#2.1 R7#2.1
USB-: 1.A7 1.B7 R4#2.1
VBAT: C8T6.1(VBAT) RET6.1(VBAT)

Not connected (* = marked no-connect by the designer): D1#2 1; D2#2 1

### Notes on the sheet
- STM32F103C8T6 (REV1)
- STM32F103RET6 (REV2)
- SWD烧录接口
- Boot设置, 复位和FN按键电路
- LED信号电平转换电路
- 去耦电容
- (near C12#2) Only for RET6
- USBC接口
- 晶振
- 3.3v稳压电路
- Labels drawn without touching a wire or pin: GND
- (in symbol C8T6) STM32F103C8T6
- (in symbol CJA1117) IN; OUT; GND
- (in symbol RET6) STM32F103RET6
- (in symbol USBC 16PIN) GND; VBUS; SBU2; CC1; DN2; DP1; DN1; DP2; SBU1; CC2; SHIELD; USB TYPE C 16PIN CONNECTOR

### Library data of the parts
1 = USBC 16PIN
C1#2 C2#2 C3#2 C4#2 C5#2 C6#2 C7#2 C8#2 C9#2 C10#2 C11#2 C12#2 = Cap: Published: 8-Jun-2000; LatestRevisionDate: 17-Jul-2002; LatestRevisionNote: Re-released for DXP Platform.; PackageReference: RAD-0.3; Publisher: Altium Limited; PackageDescription: Radial Cap, Thru-Hole; 2 Leads; 0.3 in Pin Spacing
C8T6 = C8T6
D1#2 D2#2 = TVS
FN = SW
P1 = Header 4: LatestRevisionDate: 17-Jul-2002; LatestRevisionNote: Re-released for DXP Platform.; Publisher: Altium Limited
PPTC = Fuse 1: Fuse; Published: 8-Jun-2000; LatestRevisionDate: 17-Jul-2002; LatestRevisionNote: Re-released for DXP Platform.; PackageReference: PIN-W2/E2.8; Publisher: Altium Limited; PackageDescription: Thru-Hole; 2 Leads
R1#2 R2#2 R3#2 R4#2 R5#2 R6#2 R7#2 = Res2: Published: 8-Jun-2000; LatestRevisionDate: 17-Jul-2002; LatestRevisionNote: Re-released for DXP Platform.; PackageReference: AXIAL-0.4; Publisher: Altium Limited; PackageDescription: Axial Device, Thru-Hole; 2 Leads; 0.4 in Pin Spacing
Y1 = 3225Crystal

## Nets that join several sheets
+3.3: matrixkeypad (U1.16 U2.1 U2.9 U2.14), MCU (25 pins)
+5: led (128 pins), MCU (7 pins)
GND: led (128 pins), matrixkeypad (10 pins), MCU (32 pins)